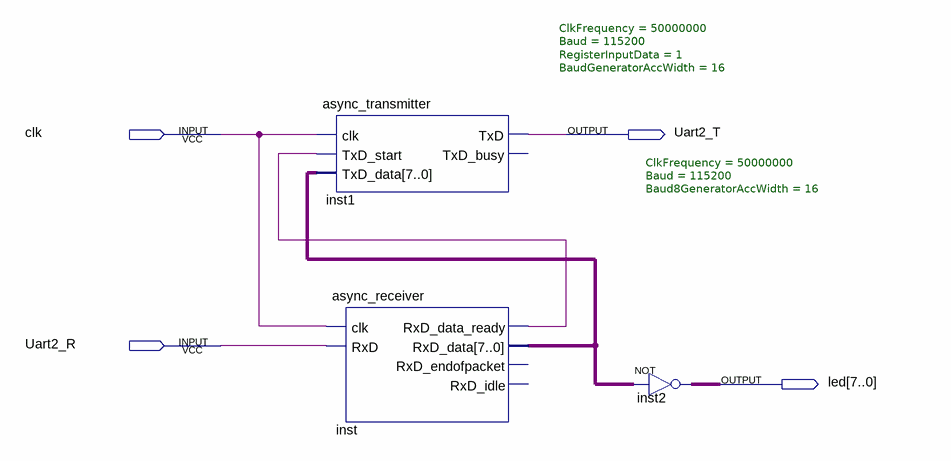
[diagram p0: schematic sheet]
// Quartus schematic RS232.bdf as structural Verilog: 3 symbols, 4 pins
module RS232 (
  input  clk,
  input  Uart2_R,
  output Uart2_T,
  output [7:0] led
);

  wire inst_rxd_data_ready;
  wire [7:0] inst_rxd_data;

  async_transmitter #(.ClkFrequency(50000000), .Baud(115200), .RegisterInputData(1), .BaudGeneratorAccWidth(16)) inst1 (
    .clk(clk), .TxD_start(inst_rxd_data_ready), .TxD_data(inst_rxd_data), .TxD(Uart2_T));  // open: TxD_busy
  async_receiver #(.ClkFrequency(50000000), .Baud(115200), .Baud8GeneratorAccWidth(16)) inst (
    .clk(clk), .RxD(Uart2_R), .RxD_data_ready(inst_rxd_data_ready), .RxD_data(inst_rxd_data));  // open: RxD_endofpacket, RxD_idle
  assign led = ~inst_rxd_data;  // NOT inst2, 8 bits wide
endmodule
